# Altium schematic sheet ADC.SchDoc: ADC
size 431 x 279 mm; Date: 19/9/2023; Engineer: Kavi Dey; Revision: 1; SheetNumber: 2; SheetTotal: 2; Project: NeoObscura; ENG_APP_DATE: 9/19/2023; DSN_APP_DATE: --/--/--; CHK_APP_DATE: --/--/--
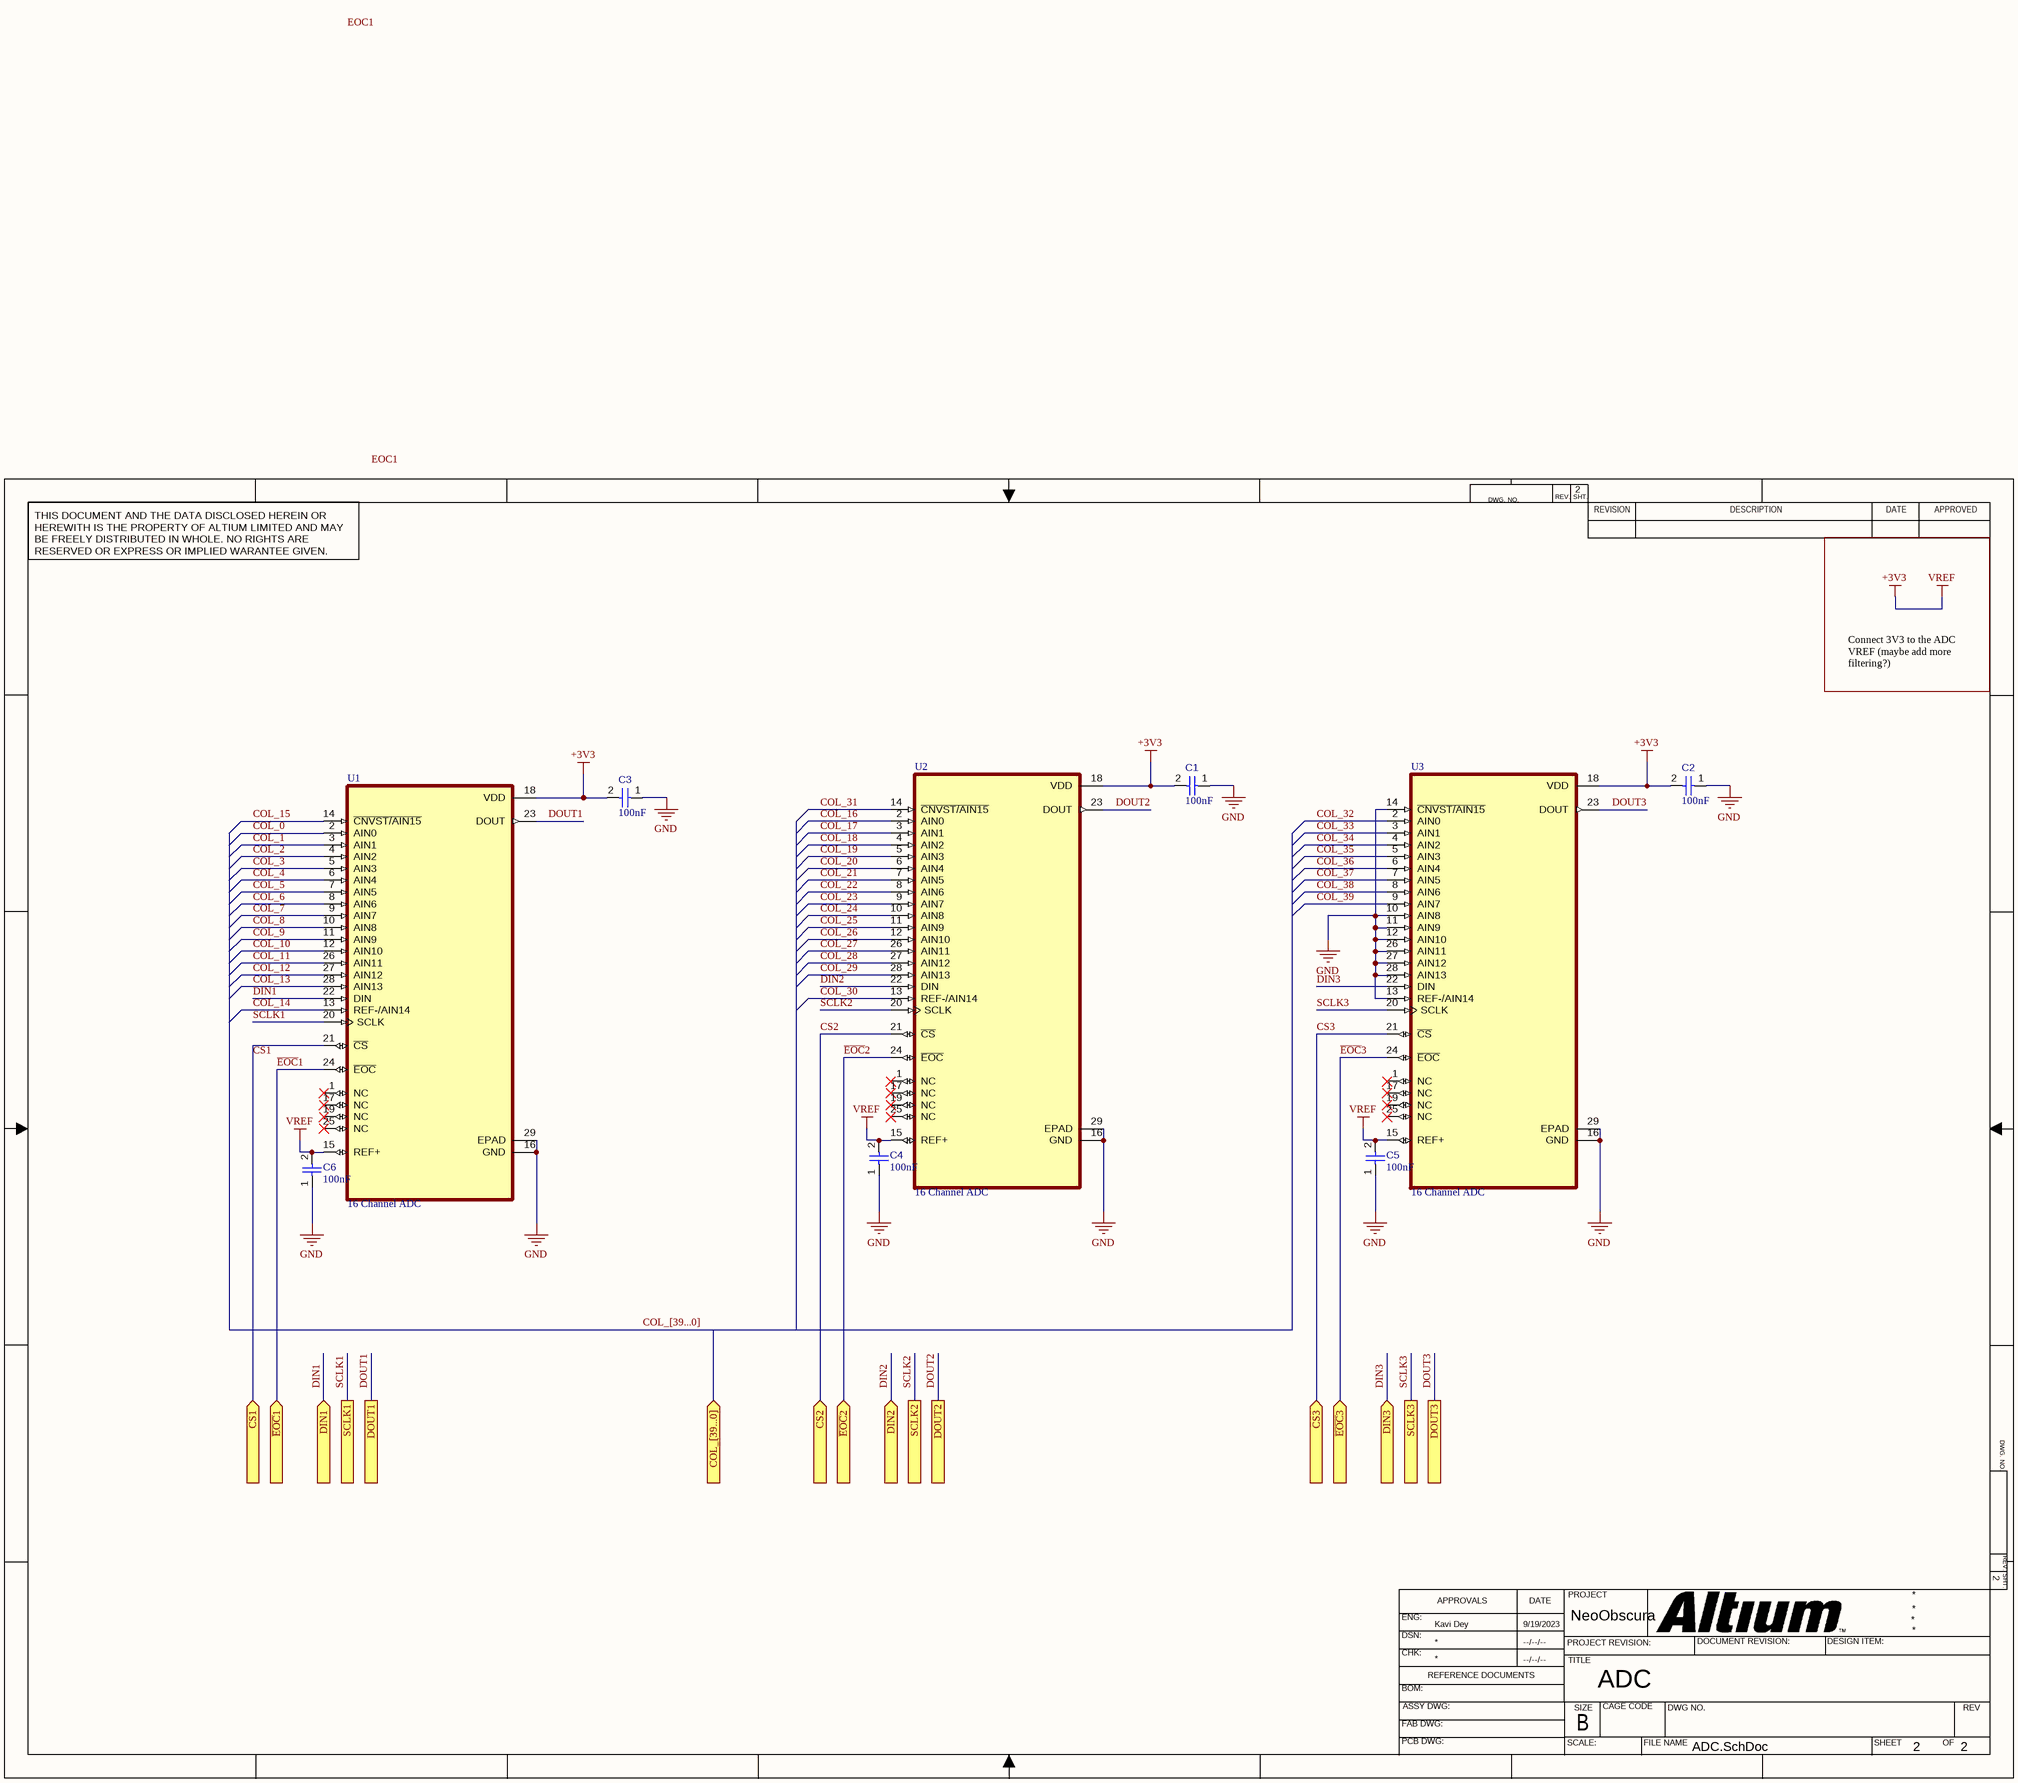
[diagram p0: ADC.SchDoc]

## Parts
C1  value 100nF  [CAPC1005X56X25LL10T15]  (hidden comment: Capacitor 0.1 uF +/- 5% 16 V 0402)
C2  value 100nF  [CAPC1005X56X25LL10T15]  (hidden comment: Capacitor 0.1 uF +/- 5% 16 V 0402)
C3  value 100nF  [CAPC1005X56X25LL10T15]  (hidden comment: Capacitor 0.1 uF +/- 5% 16 V 0402)
C4  value 100nF  [CAPC1005X56X25LL10T15]  (hidden comment: Capacitor 0.1 uF +/- 5% 16 V 0402)
C5  value 100nF  [CAPC1005X56X25LL10T15]  (hidden comment: Capacitor 0.1 uF +/- 5% 16 V 0402)
C6  value 100nF  [CAPC1005X56X25LL10T15]  (hidden comment: Capacitor 0.1 uF +/- 5% 16 V 0402)
U1  16 Channel ADC  [QFN50P500X500X80-29N]
U2  16 Channel ADC  [QFN50P500X500X80-29N]
U3  16 Channel ADC  [QFN50P500X500X80-29N]

## Ports
COL_[39...0] (in), CS1 (in), CS2 (in), CS3 (in), DIN1 (in), DIN2 (in), DIN3 (in), DOUT1, DOUT2, DOUT3, SCLK1, SCLK2, SCLK3, ~{EOC}1 (in), ~{EOC}2 (in), ~{EOC}3 (in)

## Nets
+3V3: C1.2 C2.2 C3.2 C4.2 C5.2 C6.2 U1.15(REF+) U1.18(VDD) U2.15(REF+) U2.18(VDD) U3.15(REF+) U3.18(VDD)  [also labelled VREF]
GND: C1.1 C2.1 C3.1 C4.1 C5.1 C6.1 U1.16(GND) U1.29(EPAD) U2.16(GND) U2.29(EPAD) U3.10(AIN8) U3.11(AIN9) U3.12(AIN10) U3.13(REF-/AIN14) U3.14(~{CNVST/AIN15}) U3.16(GND) U3.26(AIN11) U3.27(AIN12) U3.28(AIN13) U3.29(EPAD)
~{EOC}1: U1.24(~{EOC}) ; port ~{EOC}1
~{EOC}2: U2.24(~{EOC}) ; port ~{EOC}2
~{EOC}3: U3.24(~{EOC}) ; port ~{EOC}3
COL_0: U1.2(AIN0)
COL_1: U1.3(AIN1)
COL_2: U1.4(AIN2)
COL_3: U1.5(AIN3)
COL_4: U1.6(AIN4)
COL_5: U1.7(AIN5)
COL_6: U1.8(AIN6)
COL_7: U1.9(AIN7)
COL_8: U1.10(AIN8)
COL_9: U1.11(AIN9)
COL_10: U1.12(AIN10)
COL_11: U1.26(AIN11)
COL_12: U1.27(AIN12)
COL_13: U1.28(AIN13)
COL_14: U1.13(REF-/AIN14)
COL_15: U1.14(~{CNVST/AIN15})
COL_16: U2.2(AIN0)
COL_17: U2.3(AIN1)
COL_18: U2.4(AIN2)
COL_19: U2.5(AIN3)
COL_20: U2.6(AIN4)
COL_21: U2.7(AIN5)
COL_22: U2.8(AIN6)
COL_23: U2.9(AIN7)
COL_24: U2.10(AIN8)
COL_25: U2.11(AIN9)
COL_26: U2.12(AIN10)
COL_27: U2.26(AIN11)
COL_28: U2.27(AIN12)
COL_29: U2.28(AIN13)
COL_30: U2.13(REF-/AIN14)
COL_31: U2.14(~{CNVST/AIN15})
COL_32: U3.2(AIN0)
COL_33: U3.3(AIN1)
COL_34: U3.4(AIN2)
COL_35: U3.5(AIN3)
COL_36: U3.6(AIN4)
COL_37: U3.7(AIN5)
COL_38: U3.8(AIN6)
COL_39: U3.9(AIN7)
CS1: U1.21(~{CS}) ; port CS1
CS2: U2.21(~{CS}) ; port CS2
CS3: U3.21(~{CS}) ; port CS3
DIN1: U1.22(DIN) ; port DIN1
DIN2: U2.22(DIN) ; port DIN2
DIN3: U3.22(DIN) ; port DIN3
DOUT1: U1.23(DOUT) ; port DOUT1
DOUT2: U2.23(DOUT) ; port DOUT2
DOUT3: U3.23(DOUT) ; port DOUT3
SCLK1: U1.20(SCLK) ; port SCLK1
SCLK2: U2.20(SCLK) ; port SCLK2
SCLK3: U3.20(SCLK) ; port SCLK3

Not connected (* = marked no-connect by the designer): U1 1(NC)* 17(NC)* 19(NC)* 25(NC)*; U2 1(NC)* 17(NC)* 19(NC)* 25(NC)*; U3 1(NC)* 17(NC)* 19(NC)* 25(NC)*

## Buses and harness runs
bus COL_[39...0] = port COL_[39...0]

## Notes on the sheet
- Connect 3V3 to the ADC VREF (maybe add more filtering?)
- Labels drawn without touching a wire or pin: EOC1
- DWG. NO.
- REV.
- SHT.
- THIS DOCUMENT AND THE DATA DISCLOSED HEREIN OR HEREWITH IS THE PROPERTY OF ALTIUM LIMITED AND MAY BE FREELY DISTRIBUTED IN WHOLE. NO RIGHTS ARE RESERVED OR EXPRESS OR IMPLIED WARANTEE GIVEN.
- REVISION
- DESCRIPTION
- DATE
- APPROVED
- ENG:
- APPROVALS
- PROJECT
- DSN:
- CHK:
- REFERENCE DOCUMENTS
- PROJECT REVISION:
- TITLE
- DOCUMENT REVISION:
- DESIGN ITEM:
- BOM:
- FAB DWG:
- PCB DWG:
- ASSY DWG:
- SCALE:
- SIZE
- B
- CAGE CODE
- FILE NAME
- DWG NO.
- SHEET
- OF
- REV

## Library data of the parts
C1-C6 = CMP-001-00001-6: Chip Capacitor, 0.1 uF, +/- 5%, 16 V, 0402 (1005 Metric); Capacitor Type: Ceramic; Voltage Rating: 16V; Max Operating Temperature: 125°C; Min Operating Temperature: -55°C; Case/Package: 0402; Mounting Technology: SM; Pins: 2; Tolerance: 5%; RoHS Compliant: True
U1-U3 = MAX1031BETI+T: ADC, Successive Approximation, 10-Bit, 1 Func, 16 Channel, Serial Access, BICMOS; Manufacturer: Maxim; Max Input Voltage (AC): 1.26V; Min Input Voltage (AC): -1.24V; Linearity Error-Max (EL): 0.0977%; Number of Analog In Channels: 16; Number of Bits: 10; Channels: 1; Output Bit Code: BINARY, 2''S COMPLEMENT BINARY; Power Supplies: 3/3.3V; Sample Rate (Hz): 300kHz; Sample-and-Hold/Track-and-Hold: TRACK; Conversion Time-Max: 3.5us; Nominal Supply Voltage: 2.7V; Time @ Peak Reflow Temperature-Max (s): 30s; Qualification Status: Not Qualified; Supplier: Digi-Key; Supplier Part Number: MAX1031BETI+T-ND; Manufacturer Part Number: MAX1031BETI+T; RoHS: Yes; Category: Analog to Digital Converters (ADCs); Pricing: 2500=12.50138 (USD); Case/Package: HVQCCN; Pins: 28; Package Shape: Square; Terminal Finish: Tin; Min Operating Temperature: -40°C; Max Operating Temperature: 85°C; JESD-609 Code: e3; Output Format: Serial; Converter Type: SUCCESSIVE APPROXIMATION; Moisture Sensitivity Level: 1; Package Style: CHIP CARRIER, HEAT SINK/SLUG, VERY THIN PROFILEMeter; Peak Reflow Temperature (Cel): 260°C; Surface Mount: Yes; Technology: BICMOS; Terminal Form: No Lead; Terminal Position: QUAD; Length: 5mm; Width: 5mm; Height - Seated (Max): 0.8mm; Terminal Pitch: 0.5mm; Temperature Grade: INDUSTRIAL; Reach SVHC Compliant: Yes; RoHS Compliant: Yes; ComponentLink1URL: https://datasheet.ciiva.com:443/pdfs/VipMasterIC/IC/MAXM/MAXMS12063/MAXMS12063-1.pdf?src-supplier=IHS+Markit; ComponentLink1Description: https://datasheet.ciiva.com:443/pdfs/VipMasterIC/IC/MAXM/MAXMS12063/MAXMS12063-1.pdf?src-supplier=IHS+Markit; ComponentLink2URL: https://datasheet.ciiva.com/1317/max1027-max1031-1317413.pdf?src-supplier=Digi-Key; ComponentLink2Description: https://datasheet.ciiva.com/1317/max1027-max1031-1317413.pdf?src-supplier=Digi-Key; ComponentLink3URL: https://datasheet.ciiva.com/13060/max1027-max1031-94739-13060424.pdf?src-supplier=Mouser; ComponentLink3Description: https://datasheet.ciiva.com/13060/max1027-max1031-94739-13060424.pdf?src-supplier=Mouser